# EAGLE design se to diff v0001 (EAGLE 6.4)

## Sheet 1 of 3
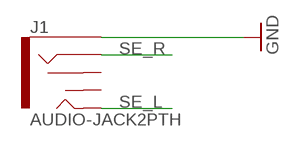
[diagram p0: schematic, sheet 1]

### Parts
J1  AUDIO-JACK2PTH  [AUDIO-JACK]

### Nets
GND: J1.SLEEVE ; also sheet 2,3
SE_L: J1.TIP ; also sheet 2
SE_R: J1.RING ; also sheet 3
Unconnected: J1.RSH J1.TSH

## Sheet 2 of 3
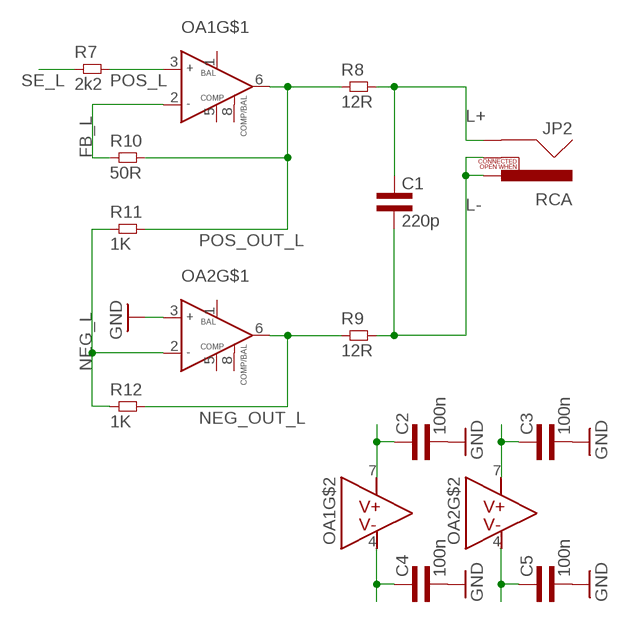
[diagram p1: schematic, sheet 2]

### Parts
C1  220p  CAP0603L3  [0603L3]
C2  100n  CAP0603L3  [0603L3]
C3  100n  CAP0603L3  [0603L3]
C4  100n  CAP0603L3  [0603L3]
C5  100n  CAP0603L3  [0603L3]
JP2  RCA  [RCA]
OA1  NE5534DSOIC8  [SOIC-8]
OA2  NE5534DSOIC8  [SOIC-8]
R7  2k2  RES0603L3  [0603L3]
R8  12R  RES0603L3  [0603L3]
R9  12R  RES0603L3  [0603L3]
R10  50R  RES0603L3  [0603L3]
R11  1K  RES0603L3  [0603L3]
R12  1K  RES0603L3  [0603L3]

### Nets
FB_L: OA1.2(IN-) R10.P$1
GND: C2.P$2 C3.P$2 C4.P$2 C5.P$2 OA2.3(IN+) ; also sheet 1,3
L+: C1.P$1 JP2.SHELL R8.P$2
L-: C1.P$2 JP2.PIN JP2.SWITCH R9.P$2
NEG_L: OA2.2(IN-) R11.P$1 R12.P$1
NEG_OUT_L: OA2.6(OUT) R9.P$1 R12.P$2
POS_L: OA1.3(IN+) R7.P$2
POS_OUT_L: OA1.6(OUT) R8.P$1 R10.P$2 R11.P$2
SE_L: R7.P$1 ; also sheet 1
V+: C2.P$1 C3.P$1 OA1.7(V+) OA2.7(V+) ; also sheet 3
V-: C4.P$1 C5.P$1 OA1.4(V-) OA2.4(V-) ; also sheet 3
Unconnected: OA1.1(BAL) OA1.5(COMP) OA1.8(COMP/BAL) OA2.1(BAL) OA2.5(COMP) OA2.8(COMP/BAL)

## Sheet 3 of 3
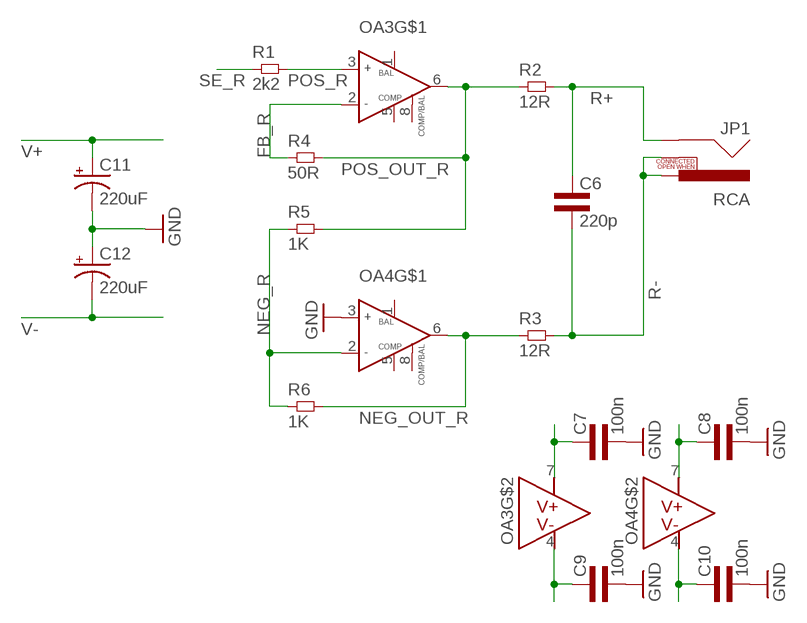
[diagram p2: schematic, sheet 3]

### Parts
C6  220p  CAP0603L3  [0603L3]
C7  100n  CAP0603L3  [0603L3]
C8  100n  CAP0603L3  [0603L3]
C9  100n  CAP0603L3  [0603L3]
C10  100n  CAP0603L3  [0603L3]
C11  220uF  CPOL-USCT7343  [CT7343]
C12  220uF  CPOL-USCT7343  [CT7343]
JP1  RCA  [RCA]
OA3  NE5534DSOIC8  [SOIC-8]
OA4  NE5534DSOIC8  [SOIC-8]
R1  2k2  RES0603L3  [0603L3]
R2  12R  RES0603L3  [0603L3]
R3  12R  RES0603L3  [0603L3]
R4  50R  RES0603L3  [0603L3]
R5  1K  RES0603L3  [0603L3]
R6  1K  RES0603L3  [0603L3]

### Nets
FB_R: OA3.2(IN-) R4.P$1
GND: C7.P$2 C8.P$2 C9.P$2 C10.P$2 C11.- C12.+ OA4.3(IN+) ; also sheet 1,2
NEG_OUT_R: OA4.6(OUT) R3.P$1 R6.P$2
NEG_R: OA4.2(IN-) R5.P$1 R6.P$1
POS_OUT_R: OA3.6(OUT) R2.P$1 R4.P$2 R5.P$2
POS_R: OA3.3(IN+) R1.P$2
R+: C6.P$1 JP1.SHELL R2.P$2
R-: C6.P$2 JP1.PIN JP1.SWITCH R3.P$2
SE_R: R1.P$1 ; also sheet 1
V+: C7.P$1 C8.P$1 C11.+ OA3.7(V+) OA4.7(V+) ; also sheet 2
V-: C9.P$1 C10.P$1 C12.- OA3.4(V-) OA4.4(V-) ; also sheet 2
Unconnected: OA3.1(BAL) OA3.5(COMP) OA3.8(COMP/BAL) OA4.1(BAL) OA4.5(COMP) OA4.8(COMP/BAL)

## Library data of the parts
C1-C10 = common:CAP
C11 C12 = rcl:CPOL-US: POLARIZED CAPACITOR, American symbol
J1 = SparkFun-Connectors:AUDIO-JACK2: Stereo audio jack with bypass switches. Used on LilyPad MP3 board. Production SKU: CONN-10353
JP1 JP2 = SparkFun-Connectors:RCA
OA1-OA4 = common:NE5534: Low-noise, high-SP audio Op Amp.; BIAS_CURRENT: 1.5uA; CMRR: 100dB; GAIN_BANDWIDTH_PRODUCT: 10MHz; IN-VOL_NOISE_DENSITY: 3.5nV; OFFSET_VOL: 4mV; OUTPUT_CURRENT: 38mA; SLEW_RATE: 13V/uS; SUPPLY_CURRENT: 4mA; SUPPLY_VOL_MAX: 30V; SUPPLY_VOL_MIN: 10V
R1-R12 = common:RES

## Board
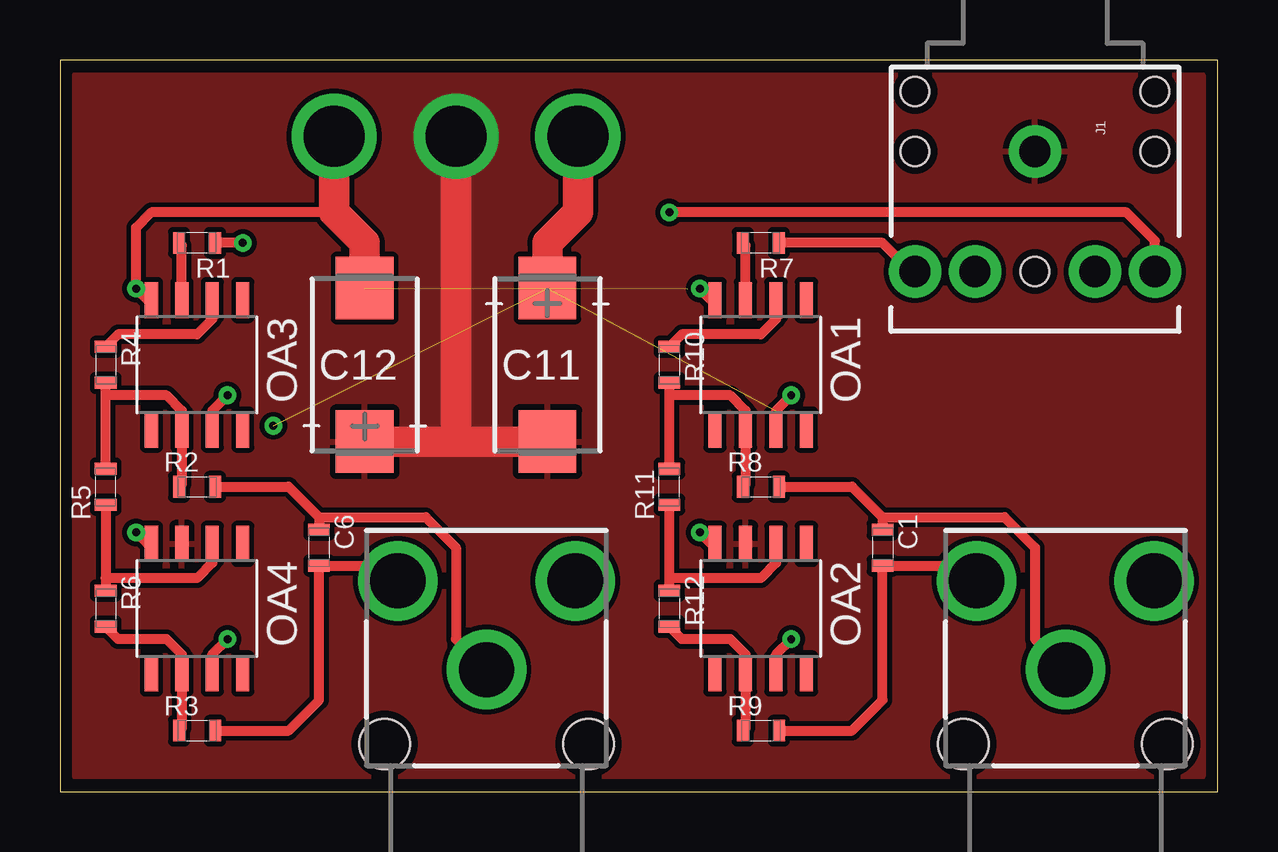
[diagram p3: board, top side]
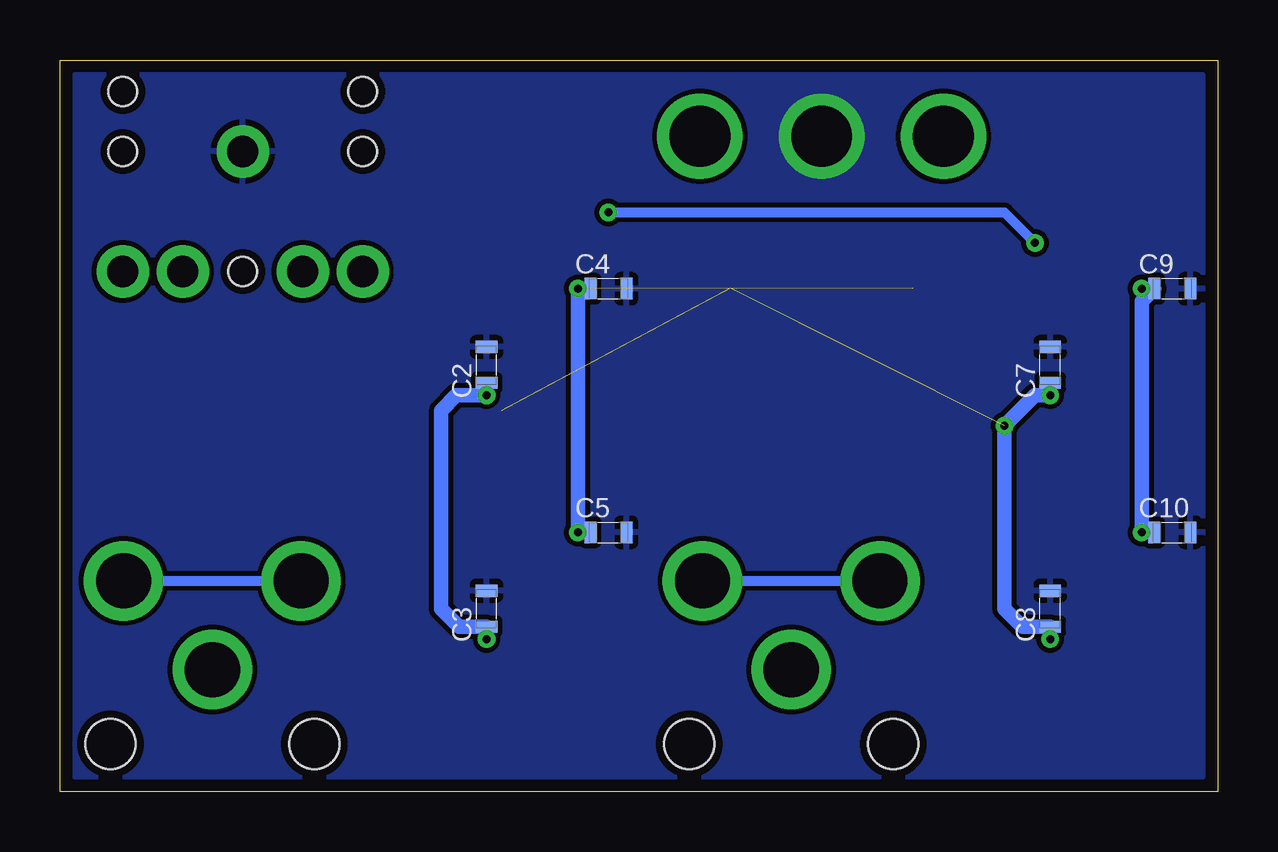
[diagram p4: board, bottom side, seen from below]

Size 48.26 x 30.48 mm. Coordinates in mm from the lower left corner, seen from the top.
Outline: 0,30.48 0,0 48.26,0 48.26,30.48 0,30.48
Copper layers (1*16): Top 0.035mm / dielectric 1.5mm / Bottom 0.035mm
Design rules "default *": minimum track width 10mil, minimum drill 24mil, track to track 8mil, track to pad 8mil, pad to pad 8mil, via to via 8mil, smd to smd 8mil, copper to edge 13mil, drill to drill 8mil, minimum pad ring 10mil, minimum via ring 8mil, stop-mask expansion 4mil, vias tented up to drill 0mil, thermal gap 10mil

### Footprints (pad centres in the part's own frame; a part is rotated, then mirrored left to right if it is on the bottom)
0603L3 = smd 0.5 x 0.9: P$1 -0.75,0; P$2 0.75,0
CT7343 = smd 2.6 x 2.4: + -3.2,0; - 3.2,0
AUDIO-JACK = drill 1.3 pad 2.184: RING 5,5; RSH 5,2.5; SLEEVE 0,0; TIP 5,-5; TSH 5,-2.5 | hole 1.2: 0,5; -2.5,5; -2.5,-5; 0,-5; 5,0
RCA = drill 2.3: PIN 3.7,3.7; SHELL 0,0; SWITCH 3.7,-3.7 | hole 2.1: -3.1,4.25; -3.1,-4.25
SOIC-8 = smd 0.55 x 1.5: 1 -1.905,-2.7; 2 -0.635,-2.7; 3 0.635,-2.7; 4 1.905,-2.7; 5 1.905,2.7; 6 0.635,2.7; 7 -0.635,2.7; 8 -1.905,2.7

### Placement (x,y rotation side)
C1  34.29,10.16 270 top
C2  30.48,17.78 90 bottom
C3  30.48,7.62 90 bottom
C4  25.4,20.95 0 bottom
C5  25.4,10.79 0 bottom
C6  10.8,10.16 270 top
C7  6.98,17.78 90 bottom
C8  6.98,7.62 90 bottom
C9  1.91,20.95 0 bottom
C10  1.91,10.79 0 bottom
C11  20.32,17.78 270 top
C12  12.7,17.78 90 top
J1  40.64,26.67 270 top
JP1  17.78,5.08 90 top
JP2  41.91,5.08 90 top
OA1  29.21,17.78 180 top
OA2  29.21,7.62 180 top
OA3  5.71,17.78 180 top
OA4  5.71,7.62 180 top
R1  5.71,22.86 180 top
R2  5.71,12.7 0 top
R3  5.71,2.54 0 top
R4  1.91,17.78 270 top
R5  1.91,12.7 90 top
R6  1.91,7.62 270 top
R7  29.21,22.86 180 top
R8  29.21,12.7 0 top
R9  29.21,2.54 0 top
R10  25.4,17.78 270 top
R11  25.4,12.7 90 top
R12  25.4,7.62 270 top

### Tracks (layer width: path | path; a pad name or v marks a point on that pad's centre or on a via)
FB_L
  Top 0.406: OA1.2 29.84,19.69 29.21,19.05 25.92,19.05 R10.P$1
FB_R
  Top 0.406: OA3.2 6.35,19.69 5.71,19.05 2.42,19.05 R4.P$1
GND  (via drill 2.54)
  Top 1.27: C11.- 16.51,14.58 | 16.51,14.58 C12.+ | v16.51,27.3 16.51,14.58
  pour Bottom: 47.62,29.84 47.62,0.63 0.63,0.63 0.63,29.84
  pour Top: 47.62,29.84 47.62,0.63 0.63,0.63 0.63,29.84
L+
  Top 0.406: R8.P$2 33.02,12.7 34.29,11.43 | 34.29,11.43 C1.P$1 | 34.29,11.43 39.37,11.43 40.64,10.16 40.64,6.35 JP2.SHELL
L-
  Top 0.406: R9.P$2 33.02,2.54 34.29,3.81 C1.P$2 37.58,9.41 JP2.PIN
  Bottom 0.406: JP2.SWITCH JP2.PIN
NEG_L
  Top 0.406: OA2.2 29.84,9.53 29.21,8.89 25.4,8.89 | 25.4,8.89 R11.P$1 | R12.P$1 25.4,8.89
NEG_OUT_L
  Top 0.406: R12.P$2 25.92,6.35 27.94,6.35 28.57,5.71 OA2.6 28.57,2.66 R9.P$1
NEG_OUT_R
  Top 0.406: R3.P$1 5.08,2.66 OA4.6 5.08,5.71 4.44,6.35 2.42,6.35 R6.P$2
NEG_R
  Top 0.406: R5.P$1 1.91,8.89 | 1.91,8.89 R6.P$1 | OA4.2 6.35,9.53 5.71,8.89 1.91,8.89
POS_L
  Top 0.406: OA1.3 28.57,22.74 R7.P$2
POS_OUT_L
  Top 0.406: 25.4,16.51 27.94,16.51 28.57,15.87 OA1.6 28.57,12.81 R8.P$1 | R11.P$2 25.4,16.51 | 25.4,16.51 R10.P$2
POS_OUT_R
  Top 0.406: R5.P$2 1.91,16.51 | 1.91,16.51 R4.P$2 | 1.91,16.51 4.44,16.51 5.08,15.87 OA3.6 5.08,12.81 R2.P$1
POS_R
  Top 0.406: OA3.3 5.08,22.74 R1.P$2
R+
  Top 0.406: R2.P$2 9.52,12.7 10.8,11.43 | 10.8,11.43 C6.P$1 | 10.8,11.43 15.24,11.43 16.51,10.16 16.51,6.35 JP1.SHELL
R-
  Top 0.406: R3.P$2 9.52,2.54 10.8,3.81 C6.P$2 13.45,9.41 JP1.PIN
  Bottom 0.406: JP1.SWITCH JP1.PIN
SE_L
  Top 0.406: J1.TIP 35.48,21.67 34.29,22.86 R7.P$1
SE_R  (via drill 0.33)
  Top 0.406: J1.RING 45.64,22.94 44.45,24.13 v25.4,24.13 | v7.62,22.86 R1.P$1
  Bottom 0.406: v25.4,24.13 8.89,24.13 v7.62,22.86
V+  (via drill 0.33, 2.54)  (2 unrouted)
  Top 0.406: OA2.7 29.84,5.71 v30.48,6.35 | OA1.7 29.84,15.87 v30.48,16.51 | OA3.7 6.35,15.87 v6.98,16.51 | OA4.7 6.35,5.71 v6.98,6.35
  Top 1.27: v21.59,27.3 21.59,24.13 20.32,22.86 C11.+
  Bottom 0.406: C3.P$1 v30.48,6.35 | C2.P$1 v30.48,16.51 | C7.P$1 v6.98,16.51 | C8.P$1 v6.98,6.35
  Bottom 0.61: C3.P$1 31.63,6.87 32.38,7.62 32.38,15.87 31.75,16.51 v30.48,16.51 | C8.P$1 8.14,6.87 8.89,7.62 v8.89,15.24 7.62,16.51 v6.98,16.51
V-  (via drill 0.33, 2.54)  (1 unrouted)
  Top 0.406: OA1.4 27.14,20.48 v26.67,20.95 | OA2.4 27.14,10.32 v26.67,10.79 | OA3.4 3.65,20.48 v3.17,20.95 3.17,23.49 3.81,24.13 11.43,24.13 | OA4.4 3.65,10.32 v3.17,10.79
  Top 1.27: v11.43,27.3 11.43,24.13 12.7,22.86 C12.-
  Bottom 0.406: C4.P$1 v26.67,20.95 | C5.P$1 v26.67,10.79 | C9.P$1 v3.17,20.95 | C10.P$1 v3.17,10.79
  Bottom 0.61: v26.67,10.79 v26.67,20.95 | v3.17,10.79 3.17,20.44 C9.P$1